# Altium schematic sheet PCI_Express_Switch.SchDoc: Apalis Evaluation Board 1.1
size A3; Organization: Toradex AG; Address1: Altsagenstrasse 5; Address2: Horw; Address3: 6048; Address4: Switzerland; DocumentNumber: 26; Revision: V1.1; SheetNumber: 26; SheetTotal: 32; PageSetup: Record=PageOptions|CenterHorizontal=True|CenterVertical=True|PrintScale=0.73|XCorrection=1.00|YCorrection=1.00|PrintKind=0|BorderSize=5000000|LeftOffset=0|BottomOffset=0|Orientation=2|PaperLength=1000|PaperWidth=1000|Scale=100|PaperSource=7|PrintQuality=-4|MediaType=1|DitherType=10|PaperKind=A4|PrintScaleMode=1
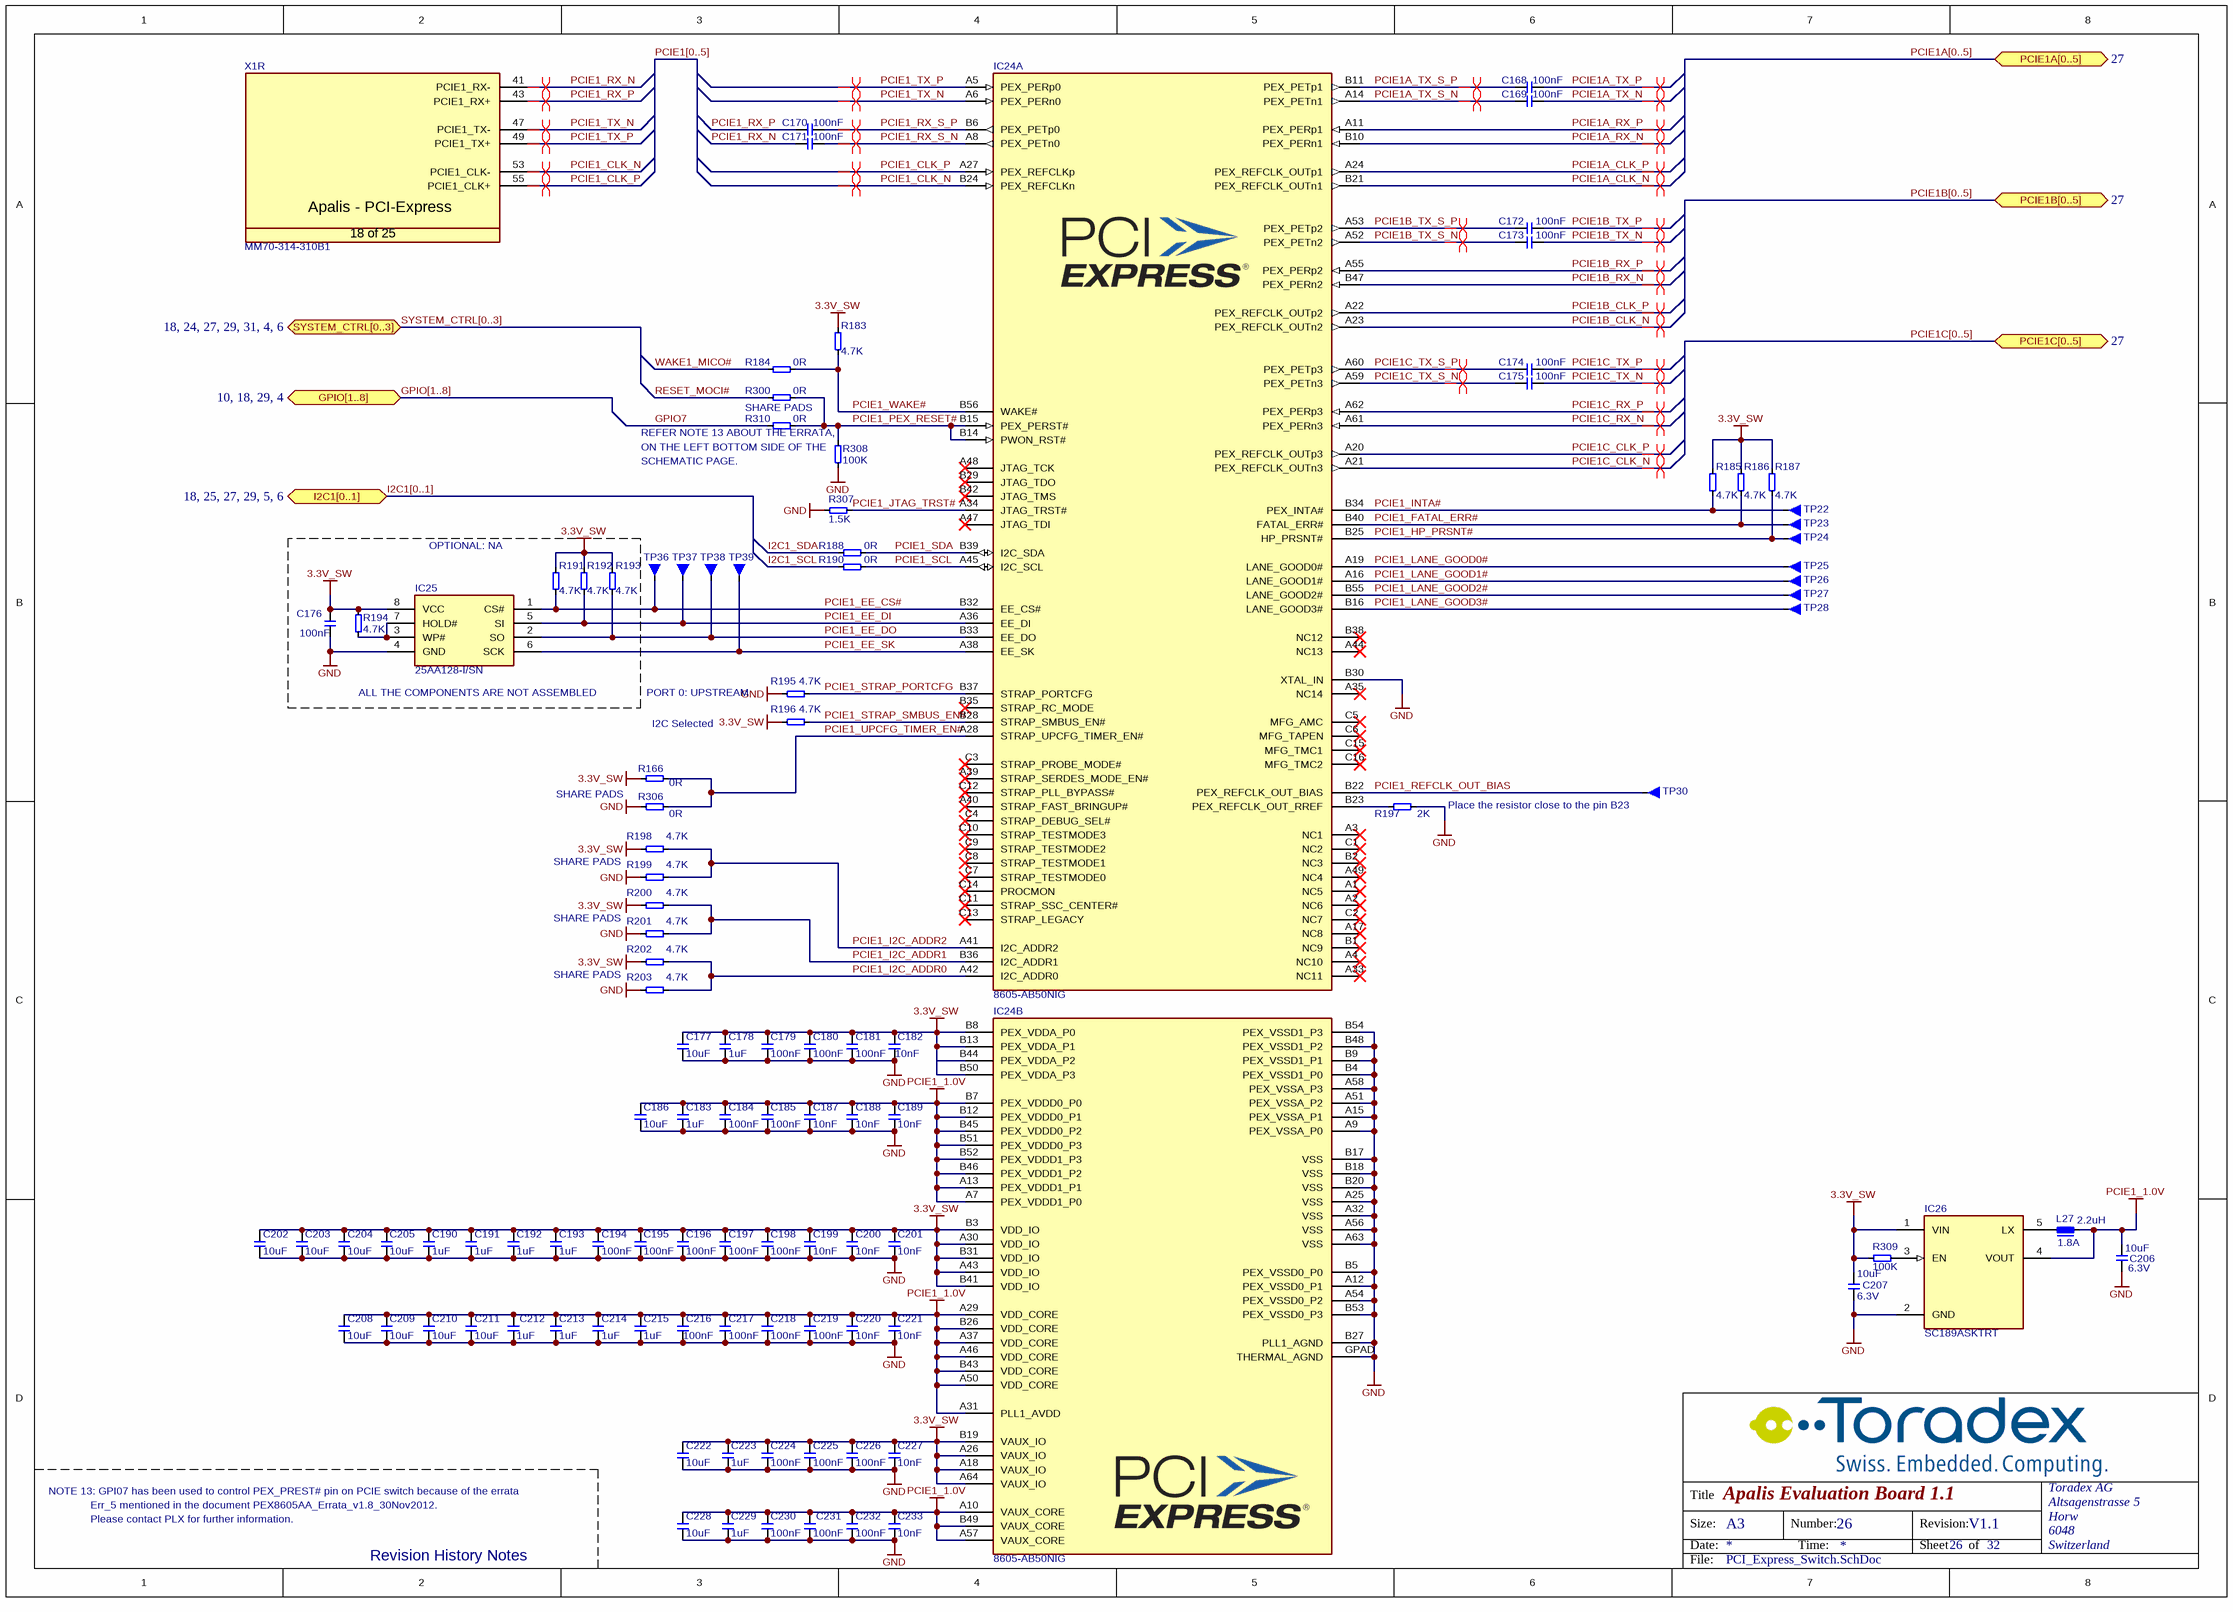
[diagram p0: PCI_Express_Switch.SchDoc]

## Parts
C168  100nF  [CAPC1005X60N]
C169  100nF  [CAPC1005X60N]
C170  100nF  [CAPC1005X60N]
C171  100nF  [CAPC1005X60N]
C172  100nF  [CAPC1005X60N]
C173  100nF  [CAPC1005X60N]
C174  100nF  [CAPC1005X60N]
C175  100nF  [CAPC1005X60N]
C176  100nF  [T_CAPC0603X33N]
C177  10uF  [T_CAPC0603X33N]
C178  1uF  [CAPC1005X60N]
C179  100nF  [CAPC1005X60N]
C180  100nF  [CAPC1005X60N]
C181  100nF  [CAPC1005X60N]
C182  10nF  [CAPC1005X60N]
C183  1uF  [CAPC1005X60N]
C184  100nF  [CAPC1005X60N]
C185  100nF  [CAPC1005X60N]
C186  10uF  [T_CAPC0603X33N]
C187  10nF  [CAPC1005X60N]
C188  10nF  [CAPC1005X60N]
C189  10nF  [CAPC1005X60N]
C190  1uF  [CAPC1005X60N]
C191  1uF  [CAPC1005X60N]
C192  1uF  [CAPC1005X60N]
C193  1uF  [CAPC1005X60N]
C194  100nF  [CAPC1005X60N]
C195  100nF  [CAPC1005X60N]
C196  100nF  [CAPC1005X60N]
C197  100nF  [CAPC1005X60N]
C198  100nF  [CAPC1005X60N]
C199  10nF  [CAPC1005X60N]
C200  10nF  [CAPC1005X60N]
C201  10nF  [CAPC1005X60N]
C202  10uF  [T_CAPC0603X33N]
C203  10uF  [T_CAPC0603X33N]
C204  10uF  [T_CAPC0603X33N]
C205  10uF  [T_CAPC0603X33N]
C206  Rating: 6.3V  [T_CAPC0805X125N]  (hidden comment: 10uF)
C207  Rating: 6.3V  [T_CAPC0805X125N]  (hidden comment: 10uF)
C208  10uF  [T_CAPC0603X33N]
C209  10uF  [T_CAPC0603X33N]
C210  10uF  [T_CAPC0603X33N]
C211  10uF  [T_CAPC0603X33N]
C212  1uF  [CAPC1005X60N]
C213  1uF  [CAPC1005X60N]
C214  1uF  [CAPC1005X60N]
C215  1uF  [CAPC1005X60N]
C216  100nF  [CAPC1005X60N]
C217  100nF  [CAPC1005X60N]
C218  100nF  [CAPC1005X60N]
C219  100nF  [CAPC1005X60N]
C220  10nF  [CAPC1005X60N]
C221  10nF  [CAPC1005X60N]
C222  10uF  [T_CAPC0603X33N]
C223  1uF  [CAPC1005X60N]
C224  100nF  [CAPC1005X60N]
C225  100nF  [CAPC1005X60N]
C226  100nF  [CAPC1005X60N]
C227  10nF  [CAPC1005X60N]
C228  10uF  [T_CAPC0603X33N]
C229  1uF  [CAPC1005X60N]
C230  100nF  [CAPC1005X60N]
C231  100nF  [CAPC1005X60N]
C232  100nF  [CAPC1005X60N]
C233  10nF  [CAPC1005X60N]
IC24  8605-AB50NIG  [QFN50P1000X1000X85-137M]  (parts A,B of 2)
IC25  25AA128-I/SN  [SOIC127P600X173-8N]
IC26  SC189ASKTRT  [SOT95P279X142-5N]
L27  Rating: 1.8A  [T_WURTH_744025002]  (hidden comment: 2.2uH)
R166  0R  [T_RESC0603X30N]
R183  4.7K  [t_RESC0603X30N]
R184  0R  [T_RESC0603X30N]
R185  4.7K  [t_RESC0603X30N]
R186  4.7K  [t_RESC0603X30N]
R187  4.7K  [t_RESC0603X30N]
R188  0R  [T_RESC0603X30N]
R190  0R  [T_RESC0603X30N]
R191  4.7K  [t_RESC0603X30N]
R192  4.7K  [t_RESC0603X30N]
R193  4.7K  [t_RESC0603X30N]
R194  4.7K  [t_RESC0603X30N]
R195  4.7K  [t_RESC0603X30N]
R196  4.7K  [t_RESC0603X30N]
R197  2K  [T_RESC0603X30N]
R198  4.7K  [t_RESC0603X30N]
R199  4.7K  [t_RESC0603X30N]
R200  4.7K  [t_RESC0603X30N]
R201  4.7K  [t_RESC0603X30N]
R202  4.7K  [t_RESC0603X30N]
R203  4.7K  [t_RESC0603X30N]
R300  0R  [T_RESC0603X30N]
R306  0R  [T_RESC0603X30N]
R307  1.5K  [T_RESC0603X30N]
R308  100K  [T_RESC0603X30N]
R309  100K  [T_RESC0603X30N]
R310  0R  [T_RESC0603X30N]
TP22  Testpin  [T_TP-THT]  (value not drawn)
TP23  Testpin  [T_TP-THT]  (value not drawn)
TP24  Testpin  [T_TP-THT]  (value not drawn)
TP25  Testpin  [T_TP-THT]  (value not drawn)
TP26  Testpin  [T_TP-THT]  (value not drawn)
TP27  Testpin  [T_TP-THT]  (value not drawn)
TP28  Testpin  [T_TP-THT]  (value not drawn)
TP30  Testpin  [T_TP-THT]  (value not drawn)
TP36  Testpin  [T_TP-THT]  (value not drawn)
TP37  Testpin  [T_TP-THT]  (value not drawn)
TP38  Testpin  [T_TP-THT]  (value not drawn)
TP39  Testpin  [T_TP-THT]  (value not drawn)
X1  Manufacturer Part No.: MM70-314-310B1  [T_JAE_MM70-314-310B1]  (hidden comment: CON-JAE-MM70-314-310B1-314-0.5mm)  (part R of 25)

## Ports
GPIO[1..8] (bidir, see 10, 18, 29, 4), I2C1[0..1] (bidir, see 18, 25, 27, 29, 5, 6), PCIE1A[0..5] (bidir, see 27), PCIE1B[0..5] (bidir, see 27), PCIE1C[0..5] (bidir, see 27), SYSTEM_CTRL[0..3] (bidir, see 18, 24, 27, 29, 31, 4, 6)

## Nets
3.3V_SW: C176.1 C177.2 C178.2 C179.2 C180.2 C181.2 C182.2 C190.2 C191.2 C192.2 C193.2 C194.2 C195.2 C196.2 C197.2 C198.2 C199.2 C200.2 C201.2 C202.2 C203.2 C204.2 C205.2 C207.2 C222.2 C223.2 C224.2 C225.2 C226.2 C227.2 IC24.A18(VAUX_IO) IC24.A26(VAUX_IO) IC24.A30(VDD_IO) IC24.A43(VDD_IO) IC24.A64(VAUX_IO) IC24.B3(VDD_IO) IC24.B8(PEX_VDDA_P0) IC24.B13(PEX_VDDA_P1) IC24.B19(VAUX_IO) IC24.B31(VDD_IO) IC24.B41(VDD_IO) IC24.B44(PEX_VDDA_P2) IC24.B50(PEX_VDDA_P3) IC25.8(VCC) IC26.1(VIN) R166.2 R183.1 R185.1 R186.1 R187.1 R191.1 R192.1 R193.1 R194.2 R196.2 R198.2 R200.2 R202.2 R309.1
GND: C176.2 C177.1 C178.1 C179.1 C180.1 C181.1 C182.1 C183.1 C184.1 C185.1 C186.1 C187.1 C188.1 C189.1 C190.1 C191.1 C192.1 C193.1 C194.1 C195.1 C196.1 C197.1 C198.1 C199.1 C200.1 C201.1 C202.1 C203.1 C204.1 C205.1 C206.1 C207.1 C208.1 C209.1 C210.1 C211.1 C212.1 C213.1 C214.1 C215.1 C216.1 C217.1 C218.1 C219.1 C220.1 C221.1 C222.1 C223.1 C224.1 C225.1 C226.1 C227.1 C228.1 C229.1 C230.1 C231.1 C232.1 C233.1 IC24.A9(PEX_VSSA_P0) IC24.A12(PEX_VSSD0_P1) IC24.A15(PEX_VSSA_P1) IC24.A25(VSS) IC24.A32(VSS) IC24.A51(PEX_VSSA_P2) IC24.A54(PEX_VSSD0_P2) IC24.A56(VSS) IC24.A58(PEX_VSSA_P3) IC24.A63(VSS) IC24.B4(PEX_VSSD1_P0) IC24.B5(PEX_VSSD0_P0) IC24.B9(PEX_VSSD1_P1) IC24.B17(VSS) IC24.B18(VSS) IC24.B20(VSS) IC24.B27(PLL1_AGND) IC24.B30(XTAL_IN) IC24.B48(PEX_VSSD1_P2) IC24.B53(PEX_VSSD0_P3) IC24.B54(PEX_VSSD1_P3) IC24.GPAD(THERMAL_AGND) IC25.4(GND) IC26.2(GND) R195.1 R197.2 R199.2 R201.2 R203.2 R306.2 R307.1 R308.2
PCIE1_1.0V: C183.2 C184.2 C185.2 C186.2 C187.2 C188.2 C189.2 C206.2 C208.2 C209.2 C210.2 C211.2 C212.2 C213.2 C214.2 C215.2 C216.2 C217.2 C218.2 C219.2 C220.2 C221.2 C228.2 C229.2 C230.2 C231.2 C232.2 C233.2 IC24.A7(PEX_VDDD1_P0) IC24.A10(VAUX_CORE) IC24.A13(PEX_VDDD1_P1) IC24.A29(VDD_CORE) IC24.A31(PLL1_AVDD) IC24.A37(VDD_CORE) IC24.A46(VDD_CORE) IC24.A50(VDD_CORE) IC24.A57(VAUX_CORE) IC24.B7(PEX_VDDD0_P0) IC24.B12(PEX_VDDD0_P1) IC24.B26(VDD_CORE) IC24.B43(VDD_CORE) IC24.B45(PEX_VDDD0_P2) IC24.B46(PEX_VDDD1_P2) IC24.B49(VAUX_CORE) IC24.B51(PEX_VDDD0_P3) IC24.B52(PEX_VDDD1_P3) IC26.4(VOUT) L27.1
GPIO7: R310.1
I2C1_SCL: R190.1
I2C1_SDA: R188.1
PCIE1_CLK_N: IC24.B24(PEX_REFCLKn) X1.53(PCIE1_CLK-)
PCIE1_CLK_P: IC24.A27(PEX_REFCLKp) X1.55(PCIE1_CLK+)
PCIE1_EE_CS#: IC24.B32(EE_CS#) IC25.1(CS#) R191.2 TP36.1
PCIE1_EE_DI: IC24.A36(EE_DI) IC25.5(SI) R192.2 TP37.1
PCIE1_EE_DO: IC24.B33(EE_DO) IC25.2(SO) R193.2 TP38.1
PCIE1_EE_SK: IC24.A38(EE_SK) IC25.6(SCK) TP39.1
PCIE1_FATAL_ERR#: IC24.B40(FATAL_ERR#) R186.2 TP23.1
PCIE1_HP_PRSNT#: IC24.B25(HP_PRSNT#) R187.2 TP24.1
PCIE1_I2C_ADDR0: IC24.A42(I2C_ADDR0) R202.1 R203.1
PCIE1_I2C_ADDR1: IC24.B36(I2C_ADDR1) R200.1 R201.1
PCIE1_I2C_ADDR2: IC24.A41(I2C_ADDR2) R198.1 R199.1
PCIE1_INTA#: IC24.B34(PEX_INTA#) R185.2 TP22.1
PCIE1_JTAG_TRST#: IC24.A34(JTAG_TRST#) R307.2
PCIE1_LANE_GOOD0#: IC24.A19(LANE_GOOD0#) TP25.1
PCIE1_LANE_GOOD1#: IC24.A16(LANE_GOOD1#) TP26.1
PCIE1_LANE_GOOD2#: IC24.B55(LANE_GOOD2#) TP27.1
PCIE1_LANE_GOOD3#: IC24.B16(LANE_GOOD3#) TP28.1
PCIE1_PEX_RESET#: IC24.B14(PWON_RST#) IC24.B15(PEX_PERST#) R300.2 R308.1 R310.2
PCIE1_REFCLK_OUT_BIAS: IC24.B22(PEX_REFCLK_OUT_BIAS) TP30.1
PCIE1_RX_N: C171.1 X1.41(PCIE1_RX-)
PCIE1_RX_P: C170.1 X1.43(PCIE1_RX+)
PCIE1_RX_S_N: C171.2 IC24.A8(PEX_PETn0)
PCIE1_RX_S_P: C170.2 IC24.B6(PEX_PETp0)
PCIE1_SCL: IC24.A45(I2C_SCL) R190.2
PCIE1_SDA: IC24.B39(I2C_SDA) R188.2
PCIE1_STRAP_PORTCFG: IC24.B37(STRAP_PORTCFG) R195.2
PCIE1_STRAP_SMBUS_EN#: IC24.B28(STRAP_SMBUS_EN#) R196.1
PCIE1_TX_N: IC24.A6(PEX_PERn0) X1.47(PCIE1_TX-)
PCIE1_TX_P: IC24.A5(PEX_PERp0) X1.49(PCIE1_TX+)
PCIE1_UPCFG_TIMER_EN#: IC24.A28(STRAP_UPCFG_TIMER_EN#) R166.1 R306.1
PCIE1_WAKE#: IC24.B56(WAKE#) R183.2 R184.2
PCIE1A_CLK_N: IC24.B21(PEX_REFCLK_OUTn1)
PCIE1A_CLK_P: IC24.A24(PEX_REFCLK_OUTp1)
PCIE1A_RX_N: IC24.B10(PEX_PERn1)
PCIE1A_RX_P: IC24.A11(PEX_PERp1)
PCIE1A_TX_N: C169.2
PCIE1A_TX_P: C168.2
PCIE1A_TX_S_N: C169.1 IC24.A14(PEX_PETn1)
PCIE1A_TX_S_P: C168.1 IC24.B11(PEX_PETp1)
PCIE1B_CLK_N: IC24.A23(PEX_REFCLK_OUTn2)
PCIE1B_CLK_P: IC24.A22(PEX_REFCLK_OUTp2)
PCIE1B_RX_N: IC24.B47(PEX_PERn2)
PCIE1B_RX_P: IC24.A55(PEX_PERp2)
PCIE1B_TX_N: C173.2
PCIE1B_TX_P: C172.2
PCIE1B_TX_S_N: C173.1 IC24.A52(PEX_PETn2)
PCIE1B_TX_S_P: C172.1 IC24.A53(PEX_PETp2)
PCIE1C_CLK_N: IC24.A21(PEX_REFCLK_OUTn3)
PCIE1C_CLK_P: IC24.A20(PEX_REFCLK_OUTp3)
PCIE1C_RX_N: IC24.A61(PEX_PERn3)
PCIE1C_RX_P: IC24.A62(PEX_PERp3)
PCIE1C_TX_N: C175.2
PCIE1C_TX_P: C174.2
PCIE1C_TX_S_N: C175.1 IC24.A59(PEX_PETn3)
PCIE1C_TX_S_P: C174.1 IC24.A60(PEX_PETp3)
RESET_MOCI#: R300.1
WAKE1_MICO#: R184.1
NetIC24_B23: IC24.B23(PEX_REFCLK_OUT_RREF) R197.1
NetIC25_3: IC25.3(WP#) IC25.7(HOLD#) R194.1
NetIC26_3: IC26.3(EN) R309.2
NetIC26_5: IC26.5(LX) L27.2

Not connected (* = marked no-connect by the designer): IC24 A1(NC5)* A2(NC6)* A3(NC1)* A4(NC10)* A17(NC8)* A33(NC11)* A35(NC14)* A39(STRAP_SERDES_MODE_EN#)* A40(STRAP_FAST_BRINGUP#)* A44(NC13)* A47(JTAG_TDI)* A48(JTAG_TCK)* A49(NC4)* B1(NC9)* B2(NC3)* B29(JTAG_TDO)* B35(STRAP_RC_MODE)* B38(NC12)* B42(JTAG_TMS)* C1(NC2)* C2(NC7)* C3(STRAP_PROBE_MODE#)* C4(STRAP_DEBUG_SEL#)* C5(MFG_AMC)* C6(MFG_TAPEN)* C7(STRAP_TESTMODE0)* C8(STRAP_TESTMODE1)* C9(STRAP_TESTMODE2)* C10(STRAP_TESTMODE3)* C11(STRAP_SSC_CENTER#)* C12(STRAP_PLL_BYPASS#)* C13(STRAP_LEGACY)* C14(PROCMON)* C15(MFG_TMC1)* C16(MFG_TMC2)*

## Buses and harness runs
bus GPIO[1..8] = port GPIO[1..8]
bus I2C1[0..1] = port I2C1[0..1]
bus PCIE1[0..5]
bus PCIE1A[0..5] = port PCIE1A[0..5]
bus PCIE1B[0..5] = port PCIE1B[0..5]
bus PCIE1C[0..5] = port PCIE1C[0..5]
bus SYSTEM_CTRL[0..3] = port SYSTEM_CTRL[0..3]

## Layout directives
differential pair: PCIE1_CLK_N, PCIE1_CLK_P, PCIE1_RX_N, PCIE1_RX_P, PCIE1_RX_S_N, PCIE1_RX_S_P, PCIE1_TX_N, PCIE1_TX_P, PCIE1A_CLK_N, PCIE1A_CLK_P, PCIE1A_RX_N, PCIE1A_RX_P, PCIE1A_TX_N, PCIE1A_TX_P, PCIE1A_TX_S_N, PCIE1A_TX_S_P, PCIE1B_CLK_N, PCIE1B_CLK_P, PCIE1B_RX_N, PCIE1B_RX_P, PCIE1B_TX_N, PCIE1B_TX_P, PCIE1B_TX_S_N, PCIE1B_TX_S_P, PCIE1C_CLK_N, PCIE1C_CLK_P, PCIE1C_RX_N, PCIE1C_RX_P, PCIE1C_TX_N, PCIE1C_TX_P, PCIE1C_TX_S_N, PCIE1C_TX_S_P

## Notes on the sheet
- (near R310) REFER NOTE 13 ABOUT THE ERRATA,
- (near R310) ON THE LEFT BOTTOM SIDE OF THE
- SCHEMATIC PAGE.
- SHARE PADS
- OPTIONAL: NA
- ALL THE COMPONENTS ARE NOT ASSEMBLED
- PORT 0: UPSTREAM
- I2C Selected
- (near TP30) Place the resistor close to the pin B23
- NOTE 13: GPI07 has been used to control PEX_PREST# pin on PCIE switch because of the errata
- Err_5 mentioned in the document PEX8605AA_Errata_v1.8_30Nov2012.
- Please contact PLX for further information.
- Revision History Notes
- Title
- Size:
- Date:
- A3
- Number:
- Time:
- Revision:
- Sheet
- of
- File:
- (in symbol CON-JAE-MM70-314-310B1-314-0.5mm, part R) Apalis - PCI-Express; 18 of 25

## Library data of the parts
C168-C175 C179-C181 C184 C185 C194-C198 C216-C219 C224-C226 C230-C232 = C-X7R-100nF-16V-10%-0402: Capacitor Ceramic X7R 100nF 16V 10% 0402; Tolerance: 10%; Type: X7R; Value: 100nF
C176 = C-X7R-100nF-16V-10%-0603: Capacitor Ceramic X7R 100nF 16V 10% 0603; Tolerance: 10%; Type: X7R; Value: 100nF
C177 C186 C202-C205 C208-C211 C222 C228 = C-X5R-10uF-6.3V-20%-0603: Capacitor Ceramic X5R 10uF 6.3V 20% 0603; Tolerance: 20%; Type: X5R; Value: 10uF
C178 C183 C190-C193 C212-C215 C223 C229 = C-X5R-1uF-16V-10%-0402: Capacitor Ceramic X5R 1uF 16V 10% 0402; Tolerance: 10%; Type: X5R; Value: 1uF
C182 C187-C189 C199-C201 C220 C221 C227 C233 = C-X7R-10nF-25V-10%-0402: Capacitor Ceramic X7R 10nF 25V 10% 0402; Tolerance: 10%; Type: X7R; Value: 10nF
C206 C207 = C-X5R-10uF-6.3V-10%-0805: Capacitor Ceramic X5R 10uF 6.3V 10% 0805; Tolerance: 10%; Type: X5R; Value: 10uF
IC24 = IC-PLX-8605-AB50NIG: 4 Ports 4 Lane PCIe Gen2 switch; Manufacturer Name: PLX; Manufacturer Part No.: 8605-AB50NIG
IC25 = IC-MC-25AA128-I/SN: 128K SPI Bus Serial EEPROM; Manufacturer Name: Microchip; Manufacturer Part No.: 25AA128-I/SN
IC26 = IC-Semtech-SC189ASKTRT: SC189ASKTRT 1.5A Synchronous  Step Down Regulator; Manufacturer Name: Semtech; Manufacturer Part No.: SC189ASKTRT
L27 = L-Wurth-744025002-2.2u-1.8A-20%: Power Choke 744025002-2.2u-1.8A-20%; Manufacturer Name: Wurth; Tolerance: 20%; Manufacturer Part No.: 744025002; Value: 2.2uH
R166 R184 R188 R190 R300 R306 R310 = R-0R-63mW-1%-0603: Resistor 0 ohm 63mW 1% 0603; Rating: 63mW; Tolerance: 1%; Value: 0R
R183 R185-R187 R191-R196 R198-R203 = R-4.7kR-63mW-5%-0603: Resistor 4.7 Kohm 63mW 5% 0603; Value: 4.7KR; Rating: 63mW; Tolerance: 5%
R197 = R-2KR-63mW-1%-0603: Resistor 2Kohm 63mW 1% 0603; Value: 2KR; Rating: 63mW; Tolerance: 1%
R307 = R-1.5KR-63mW-5%-0603: Resistor 1.5 Kohm 63mW 5% 0603; Value: 1.5KR; Rating: 63mW; Tolerance: 5%
R308 R309 = R-100KR-63mW-5%-0603: Resistor 100 Kohm 63mW 5% 0603; Value: 100KR; Rating: 63mW; Tolerance: 5%
TP22-TP28 TP30 TP36-TP39 = Testpin: Testpin TH
X1 = CON-JAE-MM70-314-310B1-314-0.5mm: MXM3 Connector; Manufacturer Name: JAE; No. of ways: 314